# EAGLE design BravaPixle Demo 10 Pixles (EAGLE 8.0.0)
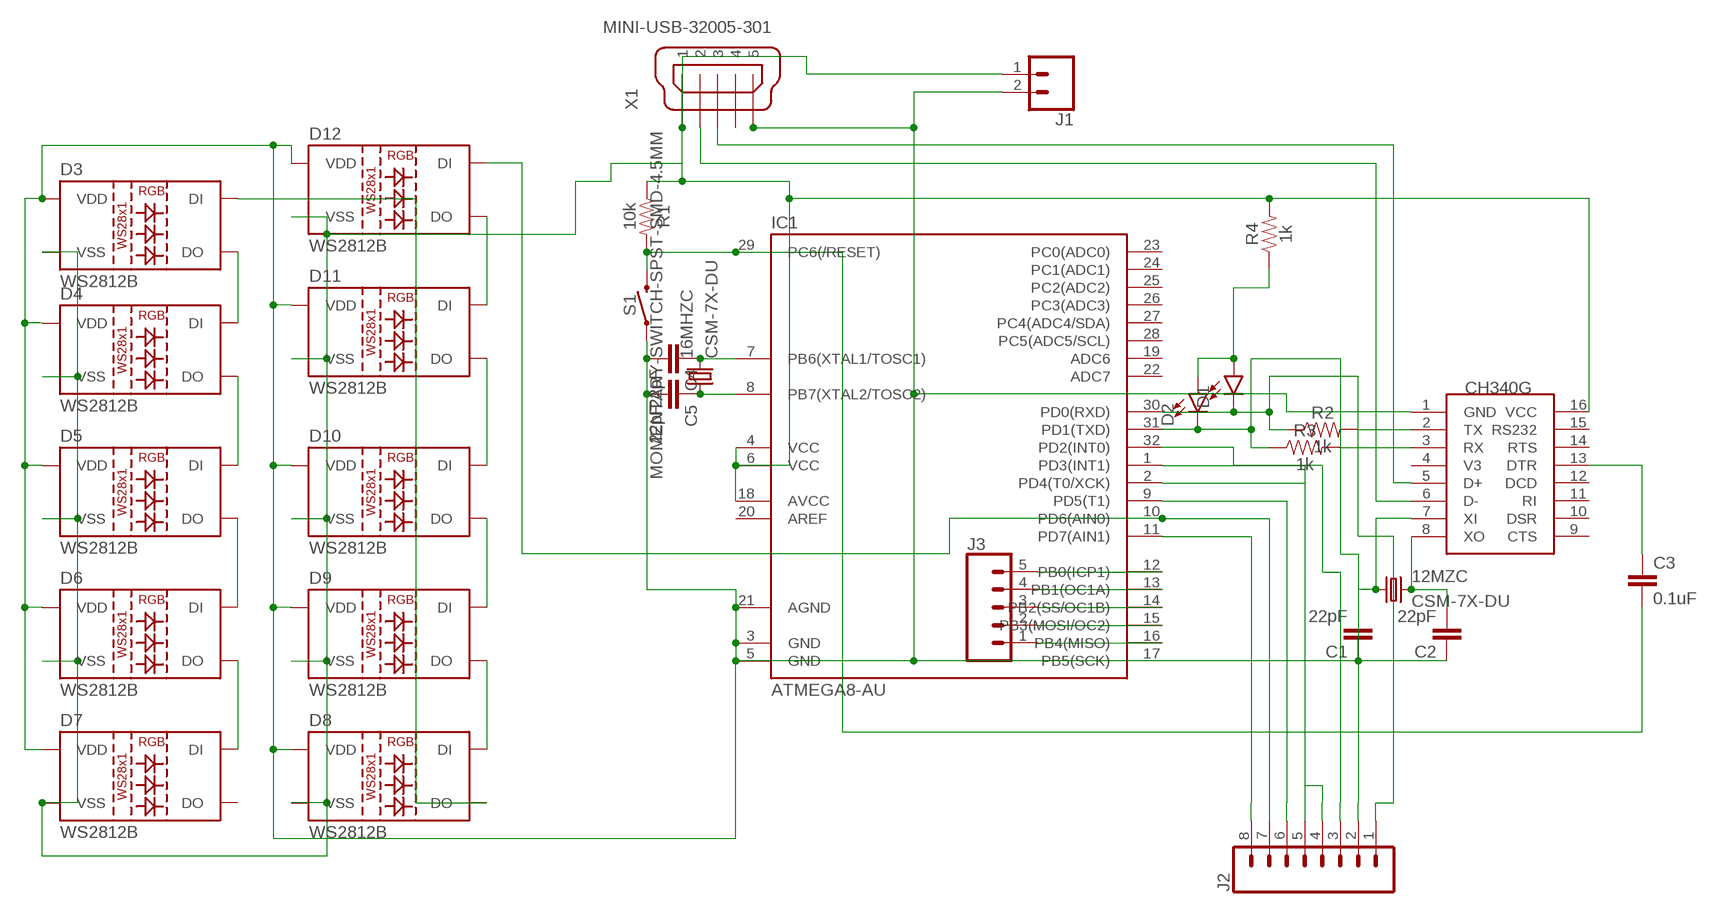
[diagram p0: schematic, sheet 1]

## Parts
12MZC  CSM-7X-DU  [CSM-7X-DU]
16MHZC  CSM-7X-DU  [CSM-7X-DU]
C1  22pF  22PF-0603-50V-5%  [0603]
C2  22pF  22PF-0603-50V-5%  [0603]
C3  0.1uF  0.1UF-0603-25V-(+80/-20%)  [0603]
C4  22pF  22PF-0603-50V-5%  [0603]
C5  22pF  22PF-0603-50V-5%  [0603]
D1  LED0603  [LED-0603]
D2  LED0603  [LED-0603]
D3  WS2812B  [WS2812B]
D4  WS2812B  [WS2812B]
D5  WS2812B  [WS2812B]
D6  WS2812B  [WS2812B]
D7  WS2812B  [WS2812B]
D8  WS2812B  [WS2812B]
D9  WS2812B  [WS2812B]
D10  WS2812B  [WS2812B]
D11  WS2812B  [WS2812B]
D12  WS2812B  [WS2812B]
IC1  ATMEGA8-AU  [TQFP32-08]
J1  CONN_02PTH3  [1X02_LONGPADS]
J2  CONN_08LOCK_LONGPADS  [1X08_LOCK_LONGPADS]
J3  CONN_05  [1X05]
R1  10k  10KOHM-0603-1/10W-1%  [0603]
R2  1k  1KOHM-0603-1/10W-1%  [0603]
R3  1k  1KOHM-0603-1/10W-1%  [0603]
R4  1k  1KOHM-0603-1/10W-1%  [0603]
S1  MOMENTARY-SWITCH-SPST-SMD-4.5MM  [TACTILE_SWITCH_SMD_4.5MM]
U$1  CH340G  [SOIC16]
X1  MINI-USB-32005-301  [32005-301]

## Nets
N$1: C3.2 IC1.29(PC6(/RESET)) R1.2 S1.1 S1.4
N$2: D11.4(DI) D12.2(DO)
N$3: D1.C IC1.30(PD0(RXD)) J2.1 R2.1
N$4: D10.4(DI) D11.2(DO)
N$5: D2.C IC1.31(PD1(TXD)) J2.2 R3.1
N$6: R2.2 U$1.2(TX)
N$7: R3.2 U$1.3(RX)
N$8: U$1.6(D-) X1.2
N$9: U$1.5(D+) X1.3
N$10: D1.A D2.A R4.1
N$11: 12MZC.2 C2.2 U$1.8(XO)
N$12: 12MZC.1 C1.2 U$1.7(XI)
N$13: D9.4(DI) D10.2(DO)
N$14: C3.1 U$1.13(DTR)
N$15: D8.4(DI) D9.2(DO)
N$16: D3.3(VSS) D4.3(VSS) D5.3(VSS) D6.3(VSS) D7.3(VSS) D8.3(VSS) D9.3(VSS) D10.3(VSS) D11.3(VSS) D12.3(VSS) IC1.4(VCC) IC1.6(VCC) IC1.18(AVCC) J1.1 R1.1 R4.2 U$1.16(VCC) X1.1
N$17: C1.1 C2.1 C4.2 C5.2 D3.1(VDD) D4.1(VDD) D5.1(VDD) D6.1(VDD) D7.1(VDD) D8.1(VDD) D9.1(VDD) D10.1(VDD) D11.1(VDD) D12.1(VDD) IC1.3(GND) IC1.5(GND) IC1.21(AGND) J1.2 S1.2 S1.3 U$1.1(GND) X1.5
N$18: D3.2(DO) D4.4(DI)
N$19: D4.2(DO) D5.4(DI)
N$20: D5.2(DO) D6.4(DI)
N$21: D6.2(DO) D7.4(DI)
N$22: D3.4(DI) D8.2(DO)
N$23: D12.4(DI) IC1.10(PD6(AIN0)) J2.7
N$24: IC1.12(PB0(ICP1)) J3.5
N$25: IC1.32(PD2(INT0)) J2.3
N$26: IC1.1(PD3(INT1)) J2.4
N$27: IC1.2(PD4(T0/XCK)) J2.5
N$28: IC1.9(PD5(T1)) J2.6
N$29: IC1.11(PD7(AIN1)) J2.8
N$30: IC1.13(PB1(OC1A)) J3.4
N$31: IC1.14(PB2(SS/OC1B)) J3.3
N$32: IC1.15(PB3(MOSI/OC2)) J3.2
N$33: IC1.16(PB4(MISO)) J3.1
N$34: 16MHZC.2 C4.1 IC1.7(PB6(XTAL1/TOSC1))
N$35: 16MHZC.1 C5.1 IC1.8(PB7(XTAL2/TOSC2))
Unconnected: D7.2(DO) IC1.17(PB5(SCK)) IC1.19(ADC6) IC1.20(AREF) IC1.22(ADC7) IC1.23(PC0(ADC0)) IC1.24(PC1(ADC1)) IC1.25(PC2(ADC2)) IC1.26(PC3(ADC3)) IC1.27(PC4(ADC4/SDA)) IC1.28(PC5(ADC5/SCL)) U$1.4(V3) U$1.9(CTS) U$1.10(DSR) U$1.11(RI) U$1.12(DCD) U$1.14(RTS) U$1.15(RS232) X1.4

## Library data of the parts
12MZC 16MHZC = crystal:CSM-7X-DU: SMD CRYSTAL Source: www.ecsxtal.com .. Crystal 3.6864MHz CSM_7X_DU.PDF; OC_FARNELL: unknown; OC_NEWARK: unknown
C1 C2 C4 C5 = SparkFun-Capacitors:22PF: 22pF ceramic capacitors A capacitor is a passive two-terminal electrical component used to store electrical energy temporarily in an electric field.; PROD_ID: CAP-07876
C3 = SparkFun-Capacitors:0.1UF: 0.1µF ceramic capacitors A capacitor is a passive two-terminal electrical component used to store electrical energy temporarily in an electric field.; PROD_ID: CAP-00810
D1 D2 = SparkFun-LED:LED: LED (Generic) Standard schematic elements and footprints for 5mm, 3mm, 1206, and 0603 sized LEDs. Generic LEDs with no color specified.
D3-D12 = SparkFun-LED:WS2812B: WS2812B SMD addressable RGB LED 5x5mm SMD LED with built-in controller IC. Color: Red/Green/Blue mC Rating: RGB: 390, 660, 180 mcd Forward Voltage: RGB: 2.0, 3.0, 3.0 V Packages:WS2812B SparkFun Products: Blynk Board - ESP8266 <https://www.sparkfun.com/products/13794>; PROD_ID: DIO-12503
IC1 = atmega8:ATMEGA8
J1 = SparkFun-Connectors:CONN_02: Multi connection point. Often used as Generic Header-pin footprint for 0.1 inch spaced/style header connections On any of the 0.1 inch spaced packages, you can populate with these: Break Away Headers - Straight <https://www.sparkfun.com/products/116> (PRT-00116) Break Away Male Headers - Right Angle <https://www.sparkfun.com/products/553> (PRT-00553) Female Headers <https://www.sparkfun.com/products/115> (PRT-00115) Break Away Headers - Machine Pin <https://www.sparkfun.com/products/117> (PRT-00117) Break Away Female Headers - Swiss Machine Pin <https://www.sparkfun.com/products/743> (PRT-00743) For SCREWTERMINALS and SPRING TERMINALS visit here: Screw Terimnals on SparkFun.com <https://www.sparkfun.com/search/results?term=Screw+Terminals> (5mm/3.5mm/2.54mm spacing) This device is also useful as a general connection point to wire up your design to another part of your project. Our various solder wires solder well into these plated through hole pads. Hook-Up Wire - Assortment (Stranded, 22 AWG) <https://www.sparkfun.com/products/11375> (PRT-11375) Hook-Up Wire - Assortment (Solid Core, 22 AWG) <https://www.sparkfun.com/products/11367> (PRT-11367) View the entire wire category on our website here <https://www.sparkfun.com/categories/141> Special notes: Molex polarized connector foot print use with: PRT-08233 with associated crimp pins and housings. 2.54_SCREWTERM for use with PRT-10571. 3.5mm Screw Terminal footprints for PRT-08084 5mm Screw Terminal footprints for use with PRT-08432
J2 = SparkFun-Connectors:CONN_08: Multi connection point. Often used as Generic Header-pin footprint for 0.1 inch spaced/style header connections On any of the 0.1 inch spaced packages, you can populate with these: Break Away Headers - Straight <https://www.sparkfun.com/products/116> (PRT-00116) Break Away Male Headers - Right Angle <https://www.sparkfun.com/products/553> (PRT-00553) Female Headers <https://www.sparkfun.com/products/115> (PRT-00115) Break Away Headers - Machine Pin <https://www.sparkfun.com/products/117> (PRT-00117) Break Away Female Headers - Swiss Machine Pin <https://www.sparkfun.com/products/743> (PRT-00743) Arduino Stackable Header - 8 Pin <https://www.sparkfun.com/products/9279> (PRT-09279) For SCREWTERMINALS and SPRING TERMINALS visit here: Screw Terimnals on SparkFun.com <https://www.sparkfun.com/search/results?term=Screw+Terminals> (5mm/3.5mm/2.54mm spacing) This device is also useful as a general connection point to wire up your design to another part of your project. Our various solder wires solder well into these plated through hole pads. Hook-Up Wire - Assortment (Stranded, 22 AWG) <https://www.sparkfun.com/products/11375> (PRT-11375) Hook-Up Wire - Assortment (Solid Core, 22 AWG) <https://www.sparkfun.com/products/11367> (PRT-11367) View the entire wire category on our website here <https://www.sparkfun.com/categories/141> Special notes: Molex polarized connector foot print use with SKU : PRT-08231 with associated crimp pins and housings. 1MM SMD Version SKU: PRT-10208 NOTES ON THE VARIANTS LOCK and LOCK_LONGPADS... This footprint was designed to help hold the alignment of a through-hole component (i.e. 6-pin header) while soldering it into place. You may notice that each hole has been shifted either up or down by 0.005 of an inch from it's more standard position (which is a perfectly straight line). This slight alteration caused the pins (the squares in the middle) to touch the edges of the holes. Because they are alternating, it causes a "brace" to hold the component in place. 0.005 has proven to be the perfect amount of "off-center" position when using our standard breakaway headers. Although looks a little odd when you look at the bare footprint, once you have a header in there, the alteration is very hard to notice. Also,if you push a header all the way into place, it is covered up entirely on the bottom side.
J3 = SparkFun-Connectors:CONN_05: Multi connection point. Often used as Generic Header-pin footprint for 0.1 inch spaced/style header connections On any of the 0.1 inch spaced packages, you can populate with these: Break Away Headers - Straight <https://www.sparkfun.com/products/116> (PRT-00116) Break Away Male Headers - Right Angle <https://www.sparkfun.com/products/553> (PRT-00553) Female Headers <https://www.sparkfun.com/products/115> (PRT-00115) Break Away Headers - Machine Pin <https://www.sparkfun.com/products/117> (PRT-00117) Break Away Female Headers - Swiss Machine Pin <https://www.sparkfun.com/products/743> (PRT-00743) For SCREWTERMINALS and SPRING TERMINALS visit here: Screw Terimnals on SparkFun.com <https://www.sparkfun.com/search/results?term=Screw+Terminals> (5mm/3.5mm/2.54mm spacing) This device is also useful as a general connection point to wire up your design to another part of your project. Our various solder wires solder well into these plated through hole pads. Hook-Up Wire - Assortment (Stranded, 22 AWG) <https://www.sparkfun.com/products/11375> (PRT-11375) Hook-Up Wire - Assortment (Solid Core, 22 AWG) <https://www.sparkfun.com/products/11367> (PRT-11367) View the entire wire category on our website here <https://www.sparkfun.com/categories/141> Special notes: Molex polarized connector foot print use with SKU : PRT-08231 with associated crimp pins and housings. 1MM SMD Version SKU: PRT-10208
R1 = SparkFun-Resistors:10KOHM: 10kΩ resistor A resistor is a passive two-terminal electrical component that implements electrical resistance as a circuit element. Resistors act to reduce current flow, and, at the same time, act to lower voltage levels within circuits. - Wikipedia; PROD_ID: RES-00824
R2-R4 = SparkFun-Resistors:1KOHM: 1kΩ resistor A resistor is a passive two-terminal electrical component that implements electrical resistance as a circuit element. Resistors act to reduce current flow, and, at the same time, act to lower voltage levels within circuits. - Wikipedia; PROD_ID: RES-07856
S1 = SparkFun-Switches:MOMENTARY-SWITCH-SPST: Momentary Switch (Pushbutton) - SPST Normally-open (NO) SPST momentary switches (buttons, pushbuttons). Variants PTH-12MM - 12mm square, through-hole Momentary Pushbutton Switch - 12mm Square <https://www.sparkfun.com/products/9190> (COM-09190) PTH-6.0MM, PTH-6.0MM-KIT - 6.0mm square, through-hole Mini Pushbutton Switch <https://www.sparkfun.com/products/97> (COM-00097) KIT package intended for soldering kit's - only one side of pads' copper is exposed. PTH-RIGHT-ANGLE-KIT - Right-angle, through-hole Right Angle Tactile Button <https://www.sparkfun.com/products/10791> - Used on SparkFun BigTime Watch Kit <https://www.sparkfun.com/products/11734> SMD-12MM - 12mm square, surface-mount Tactile Button - SMD (12mm) <https://www.sparkfun.com/products/12993> (COM-12993) Used on SparkFun PicoBoard <https://www.sparkfun.com/products/11888> SMD-4.5MM - 4.5mm Square Trackball Switch Used on SparkFun Blackberry Trackballer Breakout <https://www.sparkfun.com/products/13169> SMD-4.6MMX2.8MM - 4.60mm x 2.80mm, surface mount Used on SparkFun SAMD21 Mini Breakout <https://www.sparkfun.com/products/13664> SMD-5.2MM, SMD-5.2-REDUNDANT - 5.2mm square, surface-mount Mini Pushbutton Switch - SMD <https://www.sparkfun.com/products/8720> (COM-08720) Used on Arduino Pro Mini <https://www.sparkfun.com/products/11114> REDUNDANT package connects both switch circuits together SMD-6.0X3.5MM - 6.0 x 3.5mm, surface mount Momentary Reset Switch SMD <https://www.sparkfun.com/products/8229> (COM-08229) SMD-6.2MM-TALL - 6.2mm square, surface mount Tactile Button - SMD (6mm) <https://www.sparkfun.com/products/12992> Used on SparkFun Digital Sandbox <https://www.sparkfun.com/products/12651> SMD-RIGHT-ANGLE - Right-angle, surface mount Used on SparkFun Block for Intel® Edison - Arduino <https://www.sparkfun.com/products/13036>; PROD_ID: SWCH-09213
U$1 = ch340g:CH340G
X1 = con-cypressindustries:MINI-USB-: MINI USB-B Conector Source: www.cypressindustries.com; OC_FARNELL: unknown; OC_NEWARK: unknown

## Board
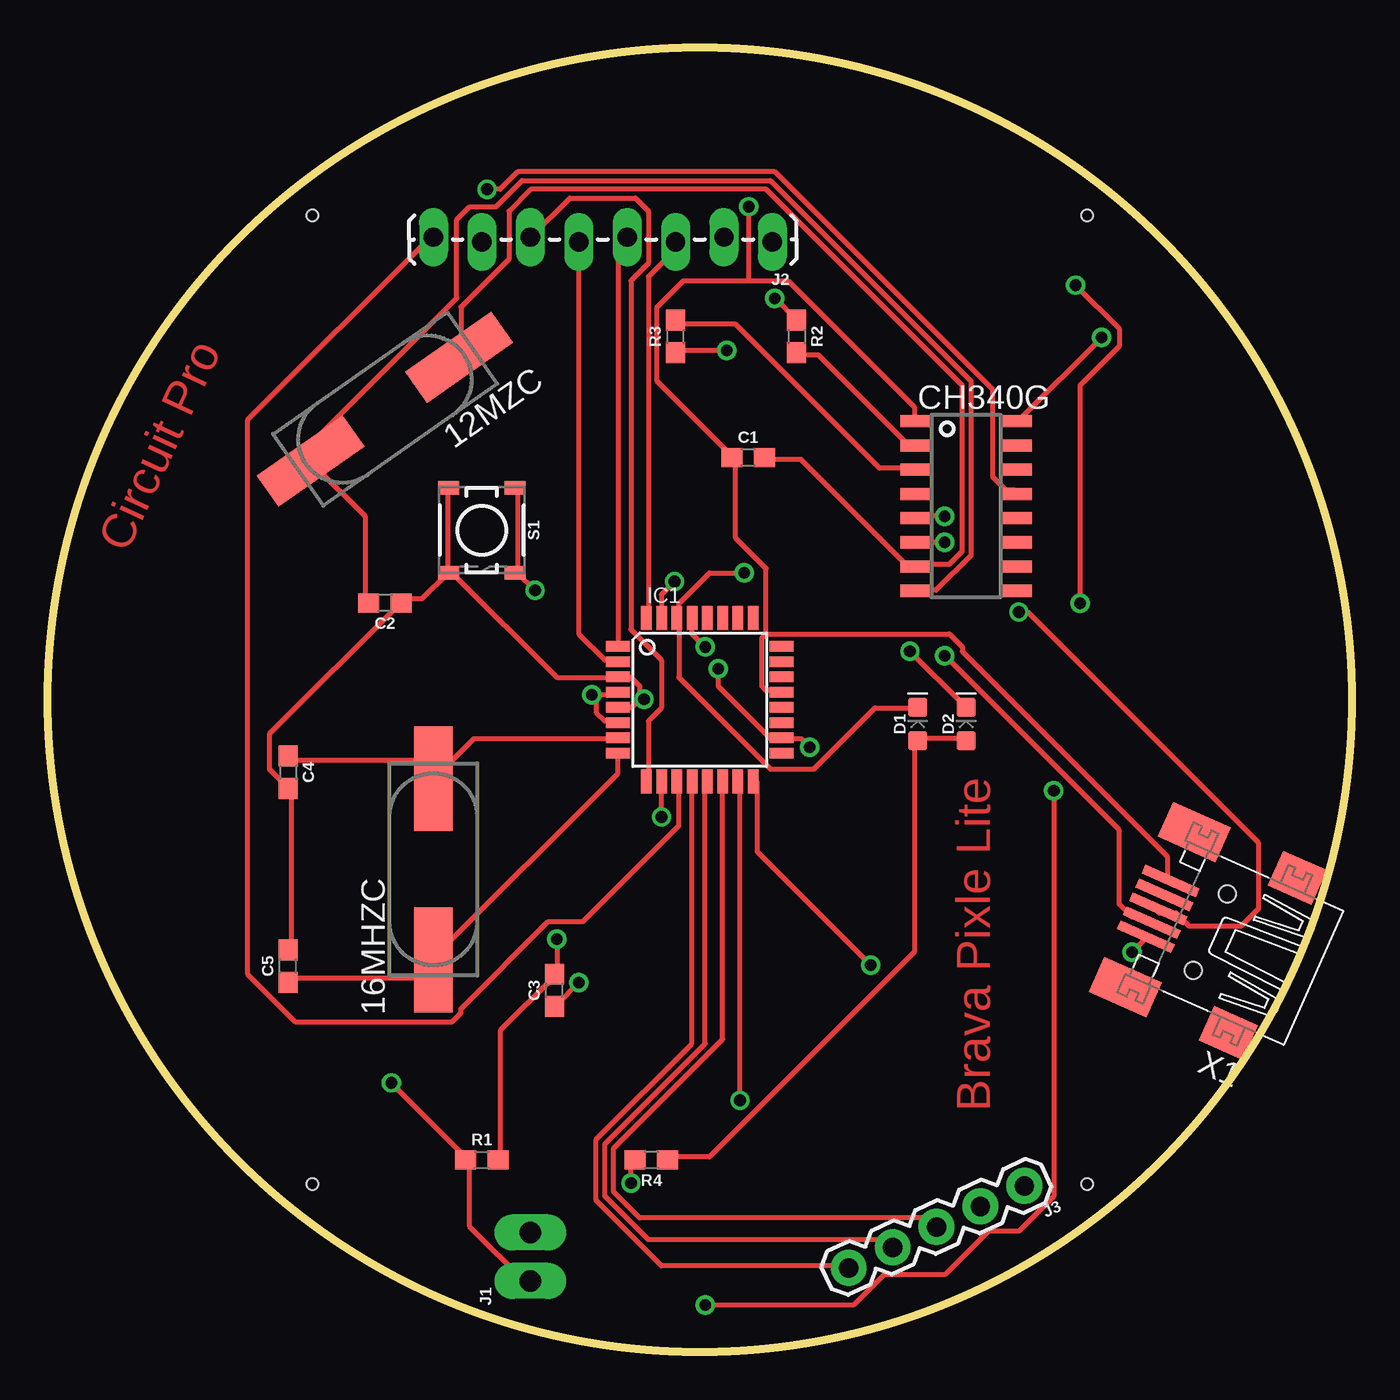
[diagram p1: board, top side]
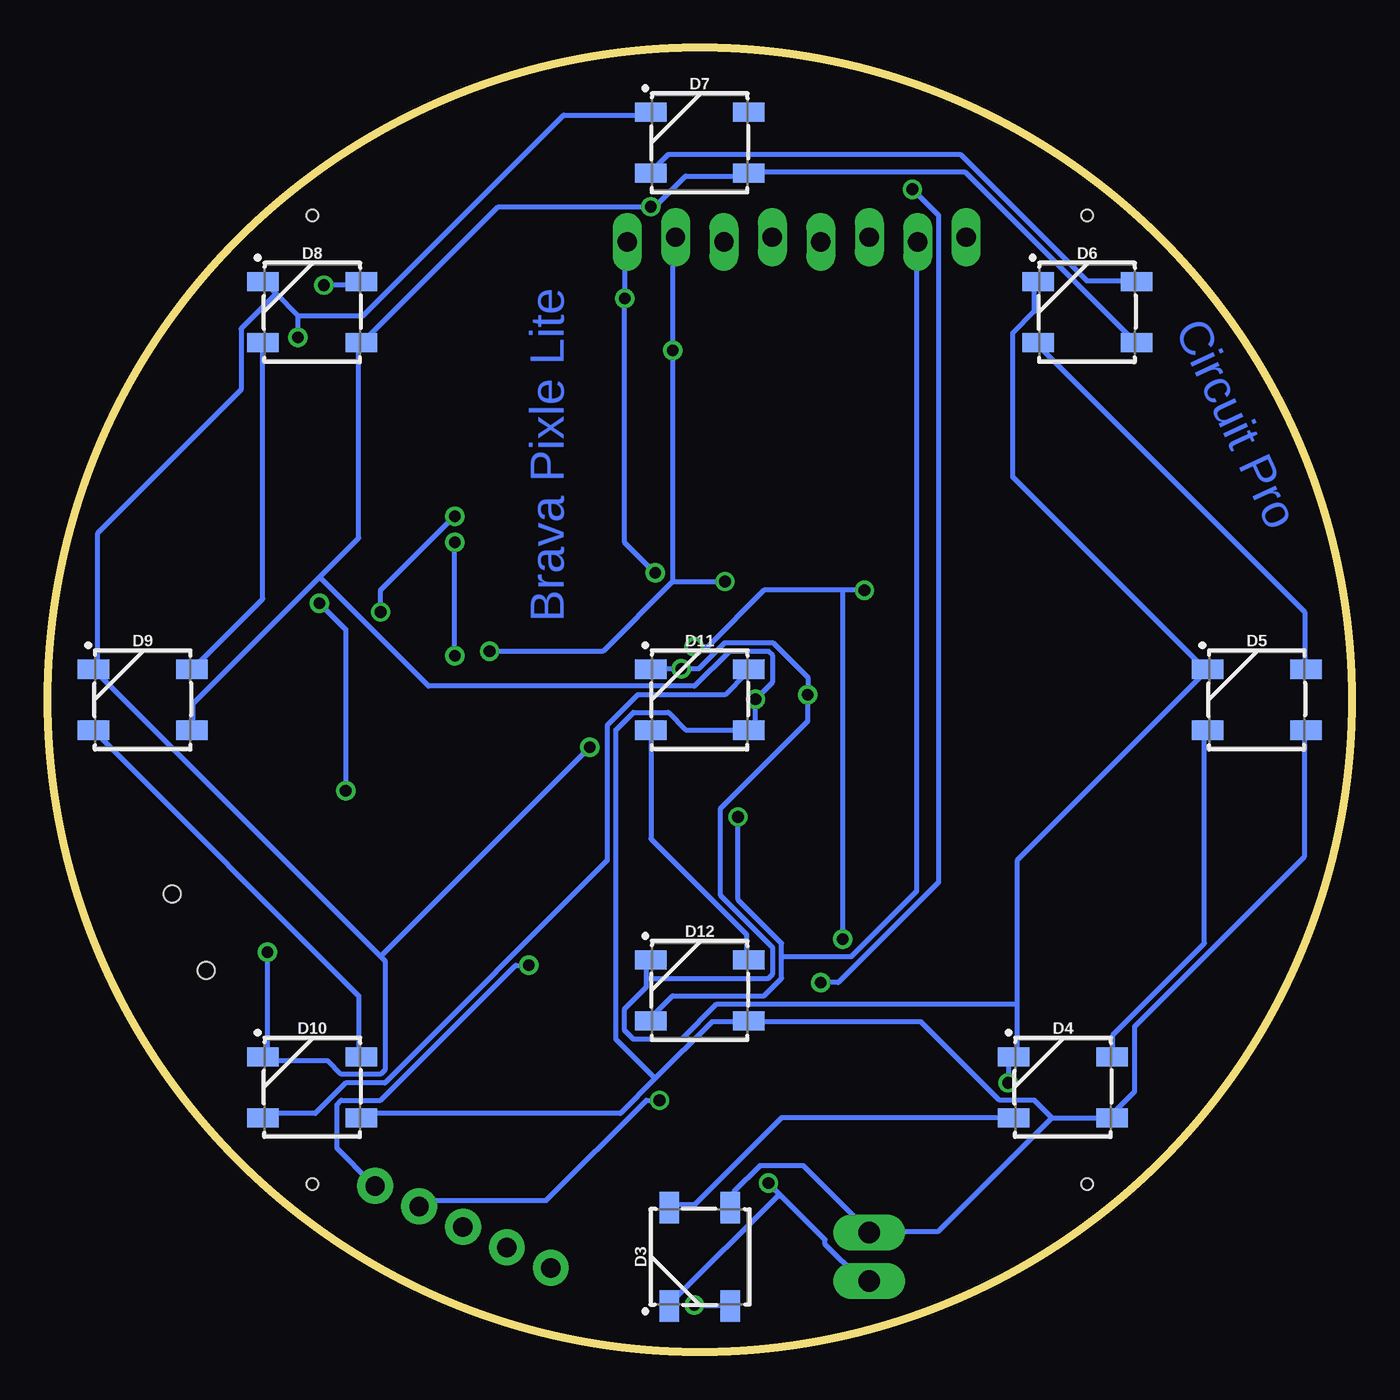
[diagram p2: board, bottom side, seen from below]

Size 68.39 x 68.39 mm. Coordinates in mm from the lower left corner, seen from the top.
Outline: circle at 34.2,34.2 radius 34.2
Copper layers (1*16): Top 0.035mm / dielectric 1.5mm / Bottom 0.035mm
Design rules "default": minimum track width 10mil, minimum drill 24mil, track to track 8mil, track to pad 8mil, pad to pad 8mil, via to via 8mil, smd to smd 8mil, copper to edge 40mil, drill to drill 8mil, minimum pad ring 10mil, minimum via ring 8mil, stop-mask expansion 4mil, vias tented up to drill 0mil, thermal gap 10mil
Holes 0.6 mm at 54.52,8.8 13.88,8.8 54.52,59.6 13.88,59.6

### Footprints (pad centres in the part's own frame; a part is rotated, then mirrored left to right if it is on the bottom)
CSM-7X-DU = smd 5.5 x 2: 1 -4.75,0; 2 4.75,0
0603 = smd 1.1 x 1: 1 -0.85,0; 2 0.85,0
LED-0603 = smd 1 x 1: A -0.877,0; C 0.877,0
WS2812B = smd 1.651 x 1: 1 2.577,-1.6; 2 2.577,1.6; 3 -2.577,1.6; 4 -2.577,-1.6
TQFP32-08 = smd 1.27 x 0.559: 1 -4.293,2.8; 2 -4.293,2; 3 -4.293,1.2; 4 -4.293,0.4; 5 -4.293,-0.4; 6 -4.293,-1.2; 7 -4.293,-2; 8 -4.293,-2.8; 17 4.293,-2.8; 18 4.293,-2; 19 4.293,-1.2; 20 4.293,-0.4; 21 4.293,0.4; 22 4.293,1.2; 23 4.293,2; 24 4.293,2.8 | smd 0.559 x 1.27: 9 -2.8,-4.293; 10 -2,-4.293; 11 -1.2,-4.293; 12 -0.4,-4.293; 13 0.4,-4.293; 14 1.2,-4.293; 15 2,-4.293; 16 2.8,-4.293; 25 2.8,4.293; 26 2,4.293; 27 1.2,4.293; 28 0.4,4.293; 29 -0.4,4.293; 30 -1.2,4.293; 31 -2,4.293; 32 -2.8,4.293
1X02_LONGPADS = drill 1.118 pad 1.88 long: 1 0,0; 2 2.54,0
1X08_LOCK_LONGPADS = drill 1.016 long: 1 0,0.127; 2 2.54,-0.127; 3 5.08,0.127; 4 7.62,-0.127; 5 10.16,0.127; 6 12.7,-0.127; 7 15.24,0.127; 8 17.78,-0.127
1X05 = drill 1.016 pad 1.88: 1 0,0; 2 2.54,0; 3 5.08,0; 4 7.62,0; 5 10.16,0
TACTILE_SWITCH_SMD_4.5MM = smd 0.7 x 1.1: 1 2.225,1.75; 2 2.225,-1.75; 3 -2.225,-1.75; 4 -2.225,1.75
SOIC16 = smd 0.635 x 1.524: 1 -4.445,-2.695; 2 -3.175,-2.695; 3 -1.905,-2.695; 4 -0.635,-2.695; 5 0.635,-2.695; 6 1.905,-2.695; 7 3.175,-2.695; 8 4.445,-2.695; 9 4.445,2.695; 10 3.175,2.695; 11 1.905,2.695; 12 0.635,2.695; 13 -0.635,2.695; 14 -1.905,2.695; 15 -3.175,2.695; 16 -4.445,2.695
32005-301 = smd 3.1 x 0.5: 1 3,1.6; 2 3,0.8; 3 3,0; 4 3,-0.8; 5 3,-1.6 | smd 2.5 x 2: M1 -3,-4.45; M2 -3,4.45 | smd 3.3 x 2: M3 2.9,4.45; M4 2.9,-4.45 | hole 0.9: 0,2.2; 0,-2.2

### Placement (x,y rotation side)
12MZC  17.69,49.44 215 top
16MHZC  20.23,25.31 90 top
C1  36.74,46.9 0 top
C2  17.69,39.28 180 top
C3  26.58,18.96 90 top
C4  12.61,30.39 270 top
C5  12.61,20.23 90 top
D1  45.63,32.93 90 top
D2  48.17,32.93 90 top
D3  34.2,4.99 90 bottom
D4  15.15,13.88 0 bottom
D5  4.99,34.2 0 bottom
D6  13.88,54.52 0 bottom
D7  34.2,63.41 0 bottom
D8  54.52,54.52 0 bottom
D9  63.41,34.2 0 bottom
D10  54.52,13.88 0 bottom
D11  34.2,34.2 0 bottom
D12  34.2,18.96 0 bottom
IC1  34.2,34.2 0 top
J1  25.31,3.72 90 top
J2  38.01,58.33 180 top
J3  51.22,8.7 205 top
R1  22.77,10.07 0 top
R2  39.28,53.25 270 top
R3  32.93,53.25 90 top
R4  31.66,10.07 180 top
S1  22.77,43.09 270 top
U$1  48.17,44.36 270 top
X1  60.98,22.01 156 top

### Tracks (layer width: path | path; a pad name or v marks a point on that pad's centre or on a via)
N$1  (via drill 0.61)
  Top 0.254: R1.2 23.73,10.22 23.73,16.85 26.47,19.59 C3.2 26.7,19.82 v26.7,21.65 | S1.4 24.65,45.19 24.65,41.08 S1.1 24.65,40.85 v25.56,39.94 | v34.47,36.96 33.79,37.65 33.79,38.34 IC1.29
  Bottom 0.254: v34.47,36.96 33.79,36.96 30.82,39.94 26.7,39.94 | v25.56,39.94 26.7,39.94 | 26.7,39.94 v26.7,21.65
N$2
  Bottom 0.254: D12.2 31.73,20.73 31.73,21.88 36.76,26.91 36.76,32.39 D11.4
N$3  (via drill 0.61)
  Top 0.254: v38.13,55.25 39.28,54.11 R2.1 | D1.C 45.45,33.76 43.39,33.76 40.19,30.56 37.9,30.56 33.1,35.36 33.1,38.34 IC1.30 33.1,38.56 33.1,39.25 34.7,40.85 v36.53,40.85
  Bottom 0.254: J2.1 38.13,58 v38.13,55.25 38.13,42.45 v36.53,40.85
N$4
  Bottom 0.254: D10.4 56.88,12.5 54.36,12.5 52.76,14.1 50.71,14.1 39.05,25.76 39.05,32.85 37.45,34.45 32.87,34.45 31.73,35.59 D11.2
N$5  (via drill 0.61)
  Top 0.254: v45.22,36.74 47.96,33.99 D2.C | v35.62,52.51 33.1,52.51 R3.1 | v32.87,40.39 32.19,39.71 32.19,38.56 IC1.31
  Bottom 0.254: v45.22,36.74 39.28,36.74 35.62,40.39 | 35.62,40.39 v35.62,52.51 35.62,58.45 J2.2 | 35.62,40.39 v32.87,40.39
N$6
  Top 0.254: R2.2 39.28,52.28 40.42,52.28 44.99,47.71 45.45,47.71 U$1.2
N$7
  Top 0.254: R3.2 33.1,53.88 36.08,53.88 43.62,46.34 45.45,46.34 U$1.3
N$8  (via drill 0.61)
  Top 0.254: v47.05,42.45 U$1.6 | v47.05,36.51 56.19,27.36 56.19,23.48 56.88,22.79 57.56,22.79 57.79,22.56 X1.2
  Bottom 0.254: v47.05,36.51 v47.05,42.45
N$9  (via drill 0.61)
  Top 0.254: v47.05,43.82 45.68,43.82 U$1.5 | v50.93,38.79 51.39,38.79 63.51,26.68 63.51,23.25 62.59,22.33 59.85,22.33 59.16,23.02 58.25,23.02 X1.3
  Bottom 0.254: v47.05,43.82 50.93,39.94 v50.93,38.79
N$10
  Top 0.254: D2.A 47.96,32.16 45.68,32.16 D1.A 45.45,31.93 45.45,20.96 34.7,10.22 32.65,10.22 R4.1
N$11
  Top 0.254: C2.2 16.64,39.48 16.64,43.82 13.9,46.57 12MZC.2 13.9,46.79 13.9,47.71 21.44,55.25 21.44,59.37 22.13,60.05 23.5,60.05 24.87,61.42 37.9,61.42 48.42,50.91 48.42,41.76 46.59,39.94 45.68,39.94 U$1.8
N$12
  Top 0.254: C1.2 37.68,46.79 39.5,46.79 44.99,41.31 45.45,41.31 U$1.7 45.68,41.31 47.28,41.31 47.96,41.99 47.96,50.68 37.68,60.97 25.33,60.97 24.19,59.82 24.19,57.31 21.67,54.79 21.67,52.28 12MZC.1
N$13
  Bottom 0.254: D10.2 52.08,15.48 52.08,18.68 65.79,32.39 D9.4
N$14  (via drill 0.61)
  Top 0.254: v27.85,19.36 26.7,18.22 C3.1 | v23.04,60.97 23.73,60.97 24.65,61.88 38.13,61.88 49.56,50.45 49.56,45.88 50.25,45.19 50.71,45.19 U$1.13
  Bottom 0.254: v27.85,19.36 26.93,19.36 21.67,24.62 21.67,59.6 v23.04,60.97
N$15
  Bottom 0.254: D8.4 57.11,52.74 57.11,39.48 60.76,35.82 D9.2
N$16  (via drill 0.61)
  Top 0.254: v56.88,20.96 57.56,21.65 X1.1 | v55.28,53.19 50.93,48.85 U$1.16 | J1.1 25.1,3.59 22.13,6.56 22.13,9.99 R1.1 21.9,10.22 v18.02,14.1 | v30.59,8.85 30.59,9.99 R4.2 | 28.76,34.22 28.76,33.54 29.22,33.08 29.9,33.08 IC1.6 | 28.76,34.22 28.99,34.45 29.9,34.45 IC1.4 | v35.16,35.82 35.16,34.91 37.9,32.16 38.36,32.16 IC1.18 38.59,32.16 39.5,32.16 v39.96,31.71 | v28.53,34.45 28.76,34.22
  Bottom 0.254: v56.88,20.96 56.88,15.48 D10.3 56.88,15.25 53.68,15.25 52.99,14.56 50.93,14.56 50.71,14.79 50.71,20.5 50.93,20.73 | 55.28,54.34 v55.28,53.19 | 56.42,55.48 56.88,55.94 D8.3 | 56.42,55.48 55.28,54.34 | 55.28,54.34 51.85,54.34 41.33,64.85 36.99,64.85 D7.3 | 56.42,55.48 58.25,53.65 58.25,50.45 65.79,42.91 65.79,35.82 D9.3 65.79,35.59 50.93,20.73 | 29.9,8.16 27.62,5.87 27.62,5.65 25.79,3.82 25.33,3.82 J1.1 | 29.9,8.16 v30.59,8.85 | 29.9,8.16 30.13,8.16 35.62,2.67 35.62,2.45 D3.3 | D11.3 36.76,35.82 v35.16,35.82 34.25,35.82 32.87,37.19 30.36,37.19 28.53,35.36 v28.53,34.45 28.53,33.08 33.1,28.51 33.1,23.93 30.36,21.19 30.36,19.82 30.59,19.59 36.99,19.59 | 17.56,18.22 17.56,25.76 7.73,35.59 D5.3 7.73,35.82 17.79,45.88 17.79,53.42 16.64,54.57 16.64,55.94 D6.3 | 17.56,18.22 17.56,15.48 D4.3 17.79,15.25 18.02,15.02 v18.02,14.1 | 36.99,19.59 36.99,19.13 38.13,17.99 38.13,16.85 37.68,16.39 35.16,16.39 33.33,18.22 17.56,18.22 | 36.99,19.59 36.99,20.5 D12.3 | v39.96,31.71 50.93,20.73
N$17  (via drill 0.61)
  Top 0.254: 37.68,37.65 37.68,41.08 36.08,42.68 36.08,46.79 C1.1 35.85,47.02 31.96,50.91 31.96,54.79 33.33,56.17 36.76,56.17 | 37.68,37.65 37.45,37.42 37.45,34.91 37.68,34.68 38.36,34.68 IC1.21 | 36.76,56.17 38.82,56.17 45.45,49.54 45.45,48.85 U$1.1 | 37.68,37.65 47.28,37.65 47.96,36.96 47.96,36.74 58.71,25.99 58.71,24.85 X1.5 | v36.76,60.05 36.76,56.17 | C5.2 12.76,21.19 12.76,29.42 C4.2 12.53,29.65 11.61,30.56 11.61,32.39 18.47,39.25 C2.1 18.7,39.48 19.62,39.48 20.99,40.85 S1.2 | 31.05,34.22 30.59,33.76 29.9,33.76 IC1.5 | 31.05,34.22 31.05,34.91 30.59,35.36 29.9,35.36 | S1.3 20.99,45.19 20.99,41.08 S1.2 | 29.9,35.36 26.7,35.36 21.22,40.85 S1.2 | 29.9,35.36 IC1.3 | v31.27,34.22 31.05,34.22
  Bottom 0.254: D6.1 11.39,52.97 20.3,61.88 31.5,61.88 D7.1 31.73,61.65 34.93,61.65 36.53,60.05 v36.76,60.05 44.76,60.05 51.85,52.97 D8.1 52.08,52.74 52.08,42.68 54.13,40.62 | 54.13,40.62 60.76,33.99 60.76,32.62 D9.1 | D3.1 32.42,7.7 32.42,8.39 31.05,9.76 28.76,9.76 25.33,6.33 J1.2 25.1,6.33 21.67,6.33 15.73,12.28 | 15.73,12.28 12.76,12.28 D4.1 12.53,12.5 11.39,13.65 11.39,17.08 2.47,25.99 2.47,32.39 D5.1 | 15.73,12.28 16.64,13.19 18.47,13.19 22.59,17.3 31.5,17.3 D12.1 31.73,17.3 33.56,17.3 36.53,14.33 | 36.53,14.33 38.36,12.5 51.85,12.5 D10.1 | 36.53,14.33 38.59,16.39 38.59,32.62 37.68,33.54 35.85,33.54 34.93,32.62 31.73,32.62 D11.1 31.5,32.62 31.27,32.85 v31.27,34.22 30.36,35.14 30.36,36.51 30.59,36.74 32.65,36.74 34.47,34.91 48.42,34.91 54.13,40.62
N$18
  Bottom 0.254: D3.2 35.62,7.7 34.47,7.7 29.9,12.28 17.79,12.28 D4.4
N$19
  Bottom 0.254: D5.4 7.73,32.39 7.73,21.42 12.53,16.62 12.53,15.48 D4.2
N$20
  Bottom 0.254: D5.2 2.47,35.82 2.47,38.79 16.42,52.74 D6.4
N$21
  Bottom 0.254: D6.2 11.39,56.17 13.9,56.17 20.53,62.8 35.85,62.8 36.76,61.88 D7.4
N$22  (via drill 0.61)
  Top 0.254: v34.47,2.45 42.25,2.45 43.85,4.05 47.05,4.05 49.33,6.33 50.93,6.33 52.76,8.16 v52.76,29.42 | v54.13,39.25 54.13,50.68 56.19,52.74 56.19,53.65 v53.91,55.94
  Bottom 0.254: v34.47,2.45 32.65,2.45 D3.4 | v52.76,29.42 52.76,37.88 v54.13,39.25 | v53.91,55.94 52.08,55.94 D8.2
N$23  (via drill 0.61)
  Top 0.254: v32.19,28.05 32.19,29.88 IC1.10
  Bottom 0.254: v32.19,28.05 32.19,23.71 29.9,21.42 29.9,20.73 | 29.9,20.73 29.9,19.59 30.82,18.68 35.62,18.68 36.76,17.53 D12.4 | 29.9,20.73 26.25,20.73 22.82,24.16 22.82,58 J2.7
N$24
  Top 0.254: IC1.12 33.79,29.88 33.79,16.16 28.76,11.13 28.76,7.93 32.19,4.5 41.79,4.5 J3.5
N$25
  Top 0.254: IC1.32 31.5,38.56 31.5,56.4 33.1,58 J2.3
N$26
  Top 0.254: IC1.1 29.9,58 30.36,58.45 J2.4
N$27
  Top 0.254: J2.5 27.85,37.65 29.22,36.28 29.9,36.28 IC1.2
N$28
  Top 0.254: IC1.9 31.5,30.11 31.5,33.08 32.19,33.76 32.19,36.28 30.59,37.88 30.59,56.17 31.5,57.08 31.5,59.82 30.82,60.51 27.39,60.51 25.33,58.45 J2.6
N$29
  Top 0.254: IC1.11 33.1,29.88 33.1,27.59 28.07,22.56 26.25,22.56 21.67,17.99 21.67,17.76 21.22,17.3 12.99,17.3 10.47,19.82 10.47,48.85 20.07,58.45 J2.8
N$30
  Top 0.254: IC1.13 34.47,29.88 34.47,16.16 29.22,10.9 29.22,8.16 31.5,5.87 44.08,5.87 44.3,5.65 J3.4
N$31
  Top 0.254: IC1.14 35.39,29.88 35.39,16.39 29.67,10.68 29.67,8.39 31.05,7.02 46.13,7.02 46.59,6.56 J3.3
N$32  (via drill 0.61)
  Top 0.254: v36.3,13.19 36.3,29.88 IC1.15
  Bottom 0.254: v36.3,13.19 36.99,13.19 42.25,7.93 48.65,7.93 48.88,7.7 J3.2
N$33  (via drill 0.61)
  Top 0.254: v43.16,20.28 37.22,26.22 37.22,29.88 IC1.16
  Bottom 0.254: v43.16,20.28 43.85,20.28 50.93,13.19 52.99,13.19 53.22,12.96 53.22,10.68 51.39,8.85 J3.1
N$34
  Top 0.254: C4.1 12.76,31.02 19.16,31.02 20.07,30.11 16MHZC.2 20.3,30.11 22.36,32.16 29.9,32.16 IC1.7
N$35
  Top 0.254: C5.1 12.76,19.59 19.16,19.59 20.07,20.5 16MHZC.1 20.3,20.73 29.9,30.33 IC1.8

### Text on the board
Top: Circuit Pro | Brava Pixle Lite
Bottom: Brava Pixle Lite | Circuit Pro